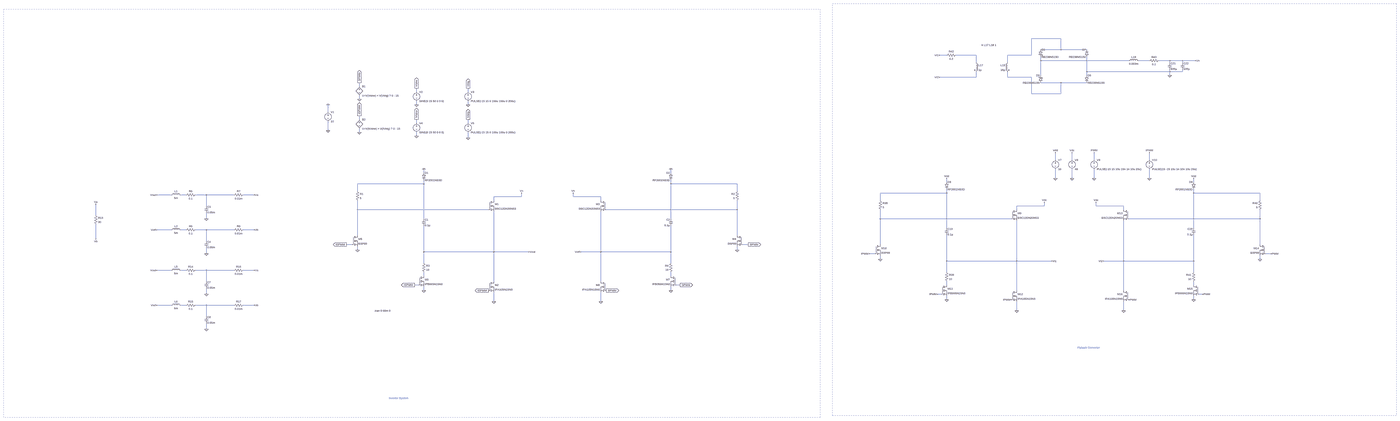
[diagram p0: schematic VFD.asc, whole sheet]
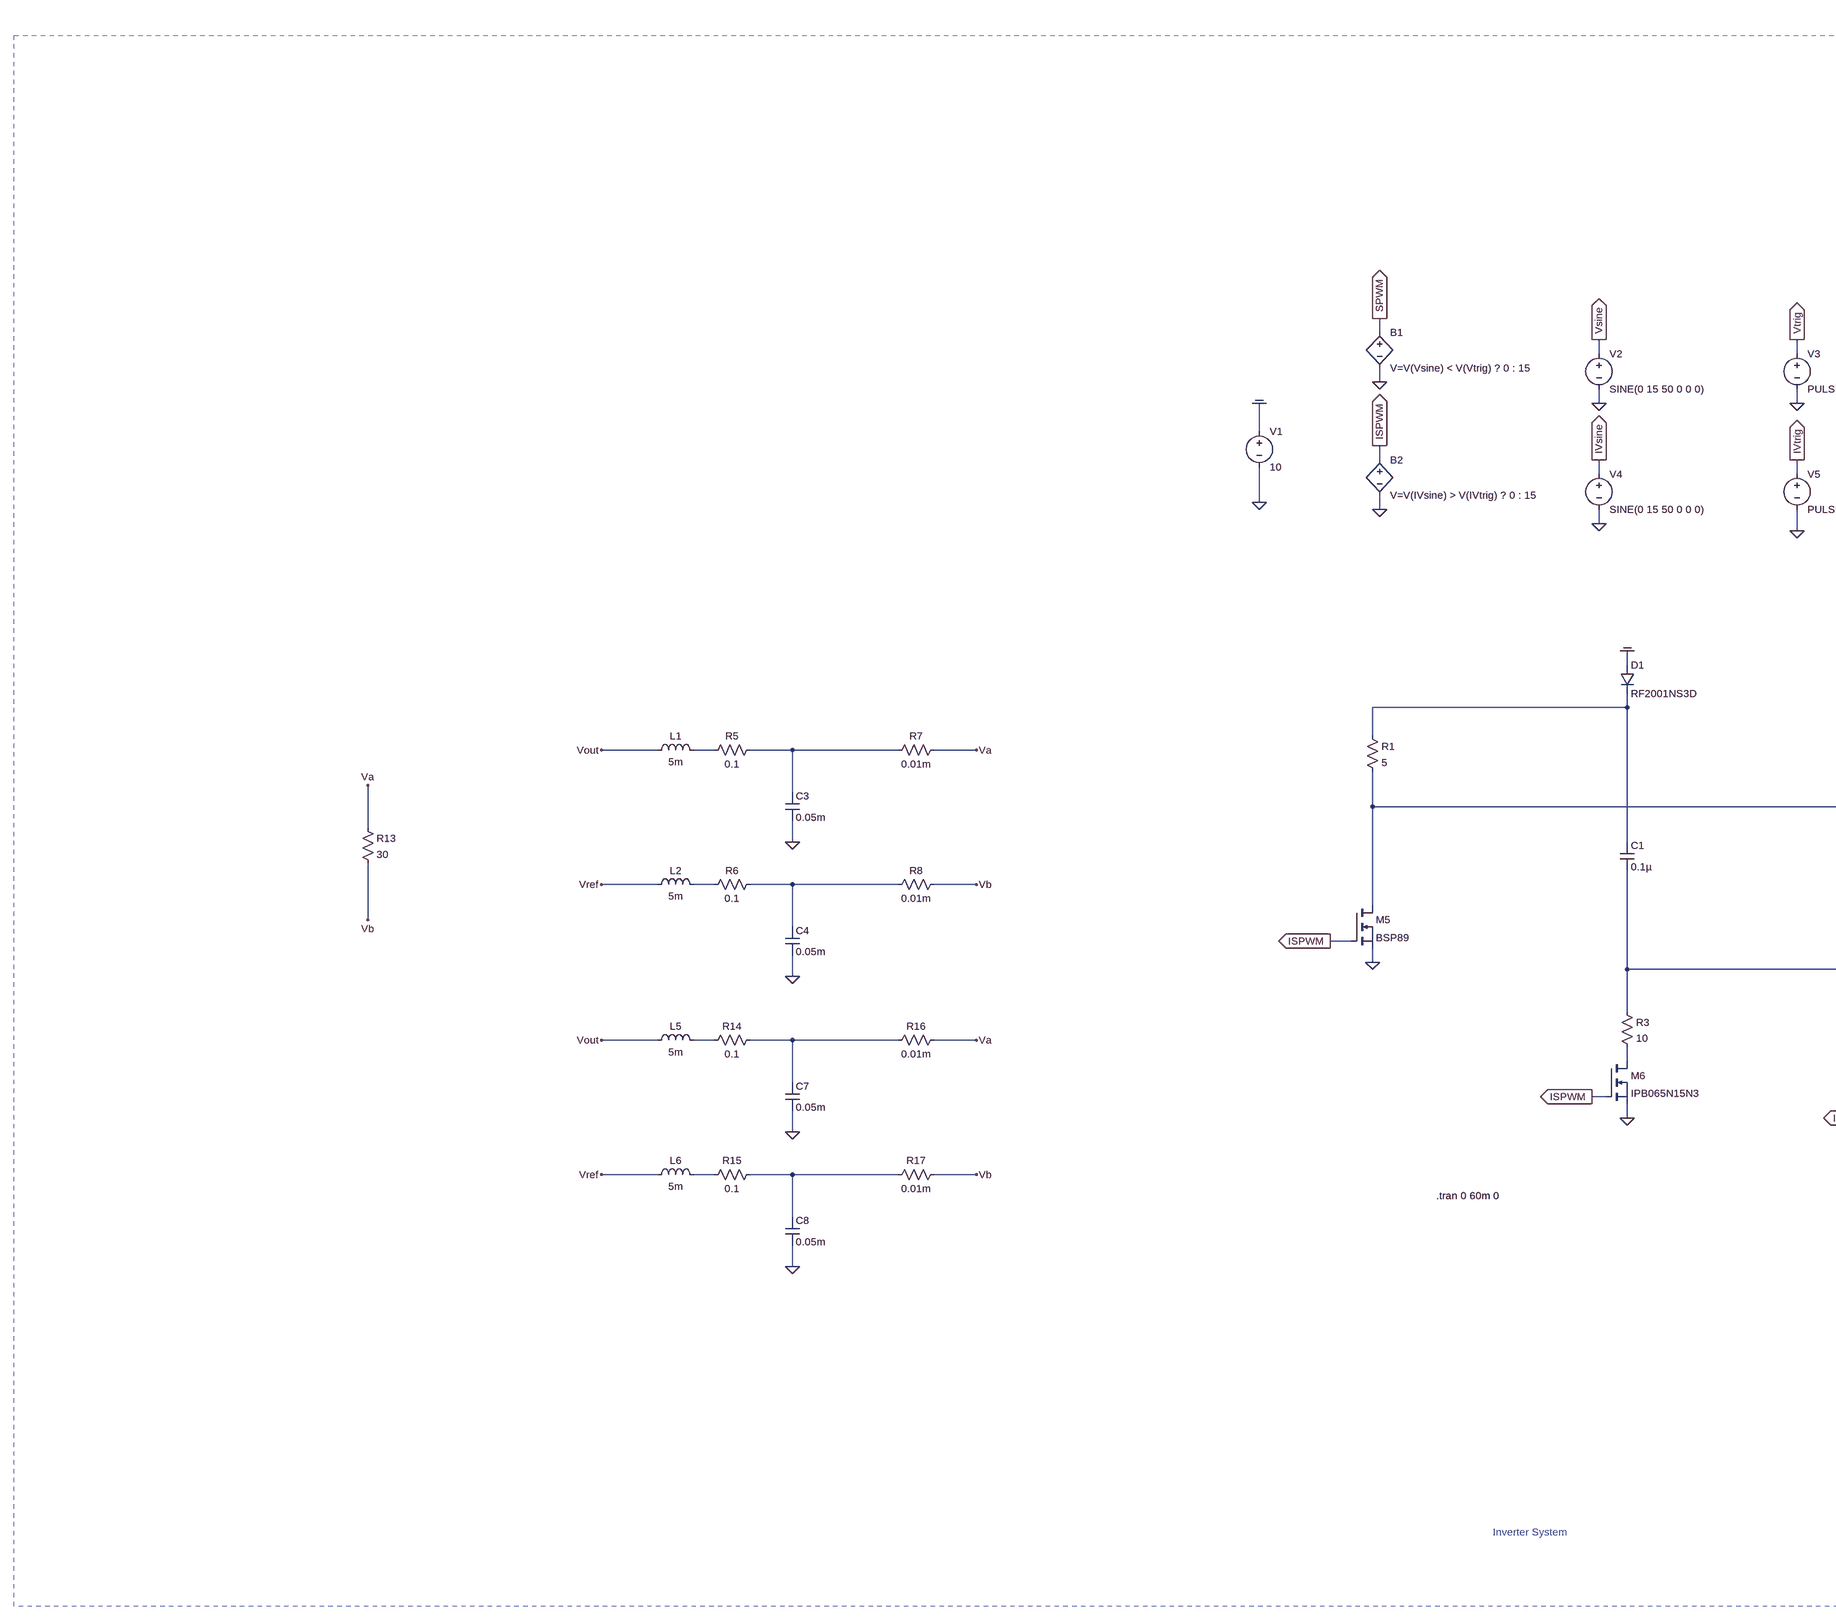
[diagram p1: schematic VFD.asc, part, row 1 of 1, column 1 of 3]
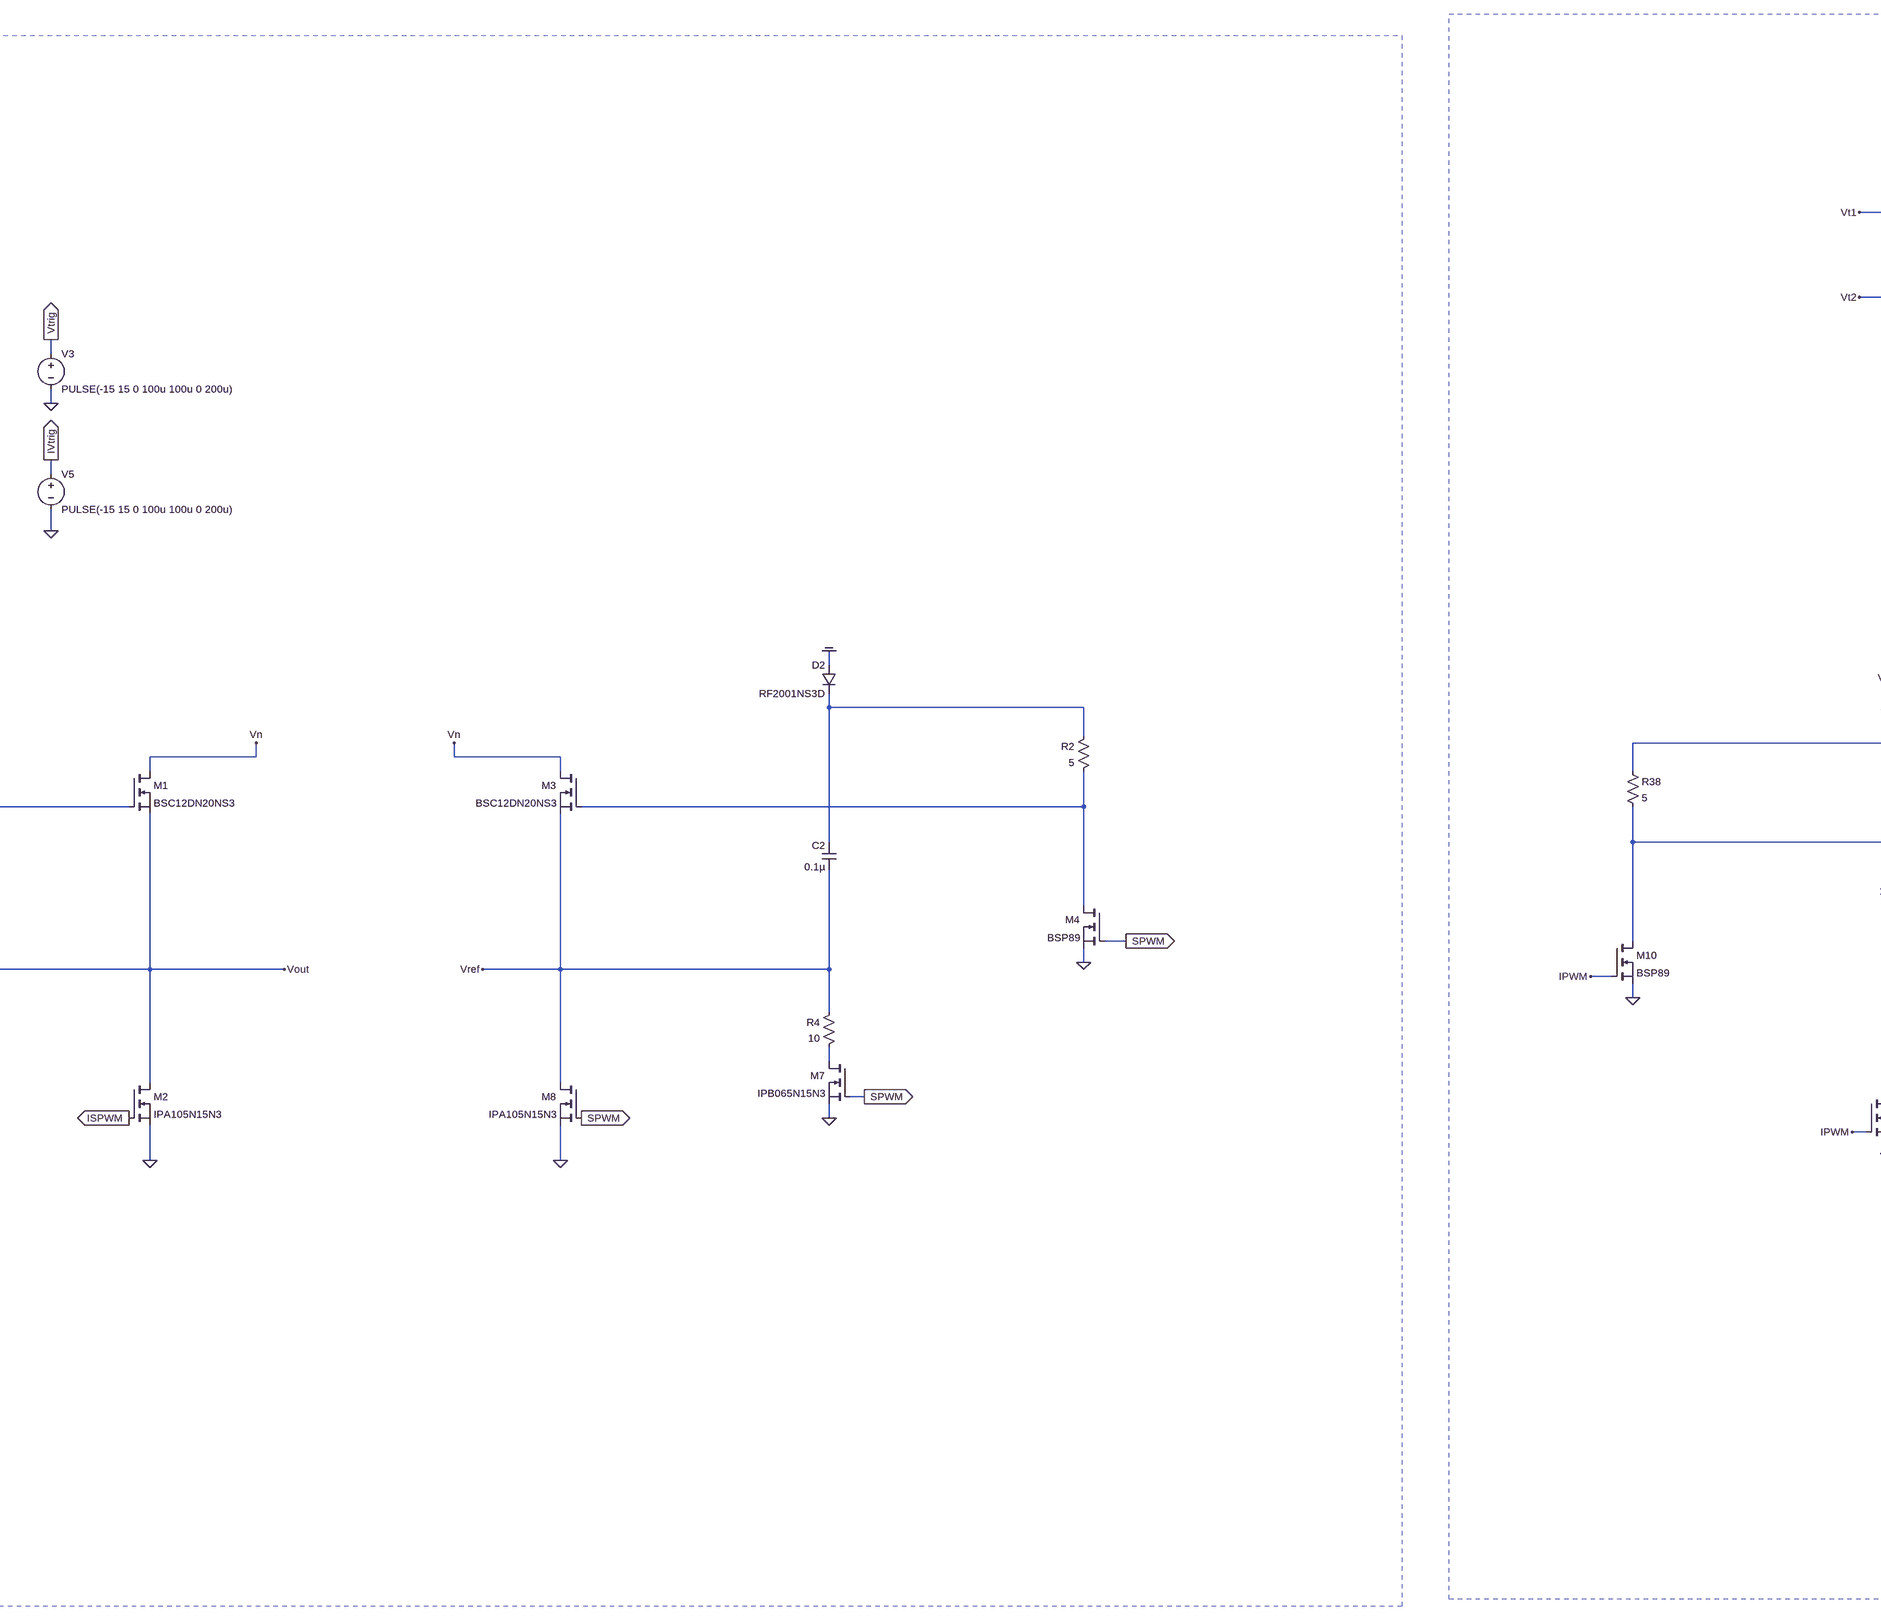
[diagram p2: schematic VFD.asc, part, row 1 of 1, column 2 of 3]
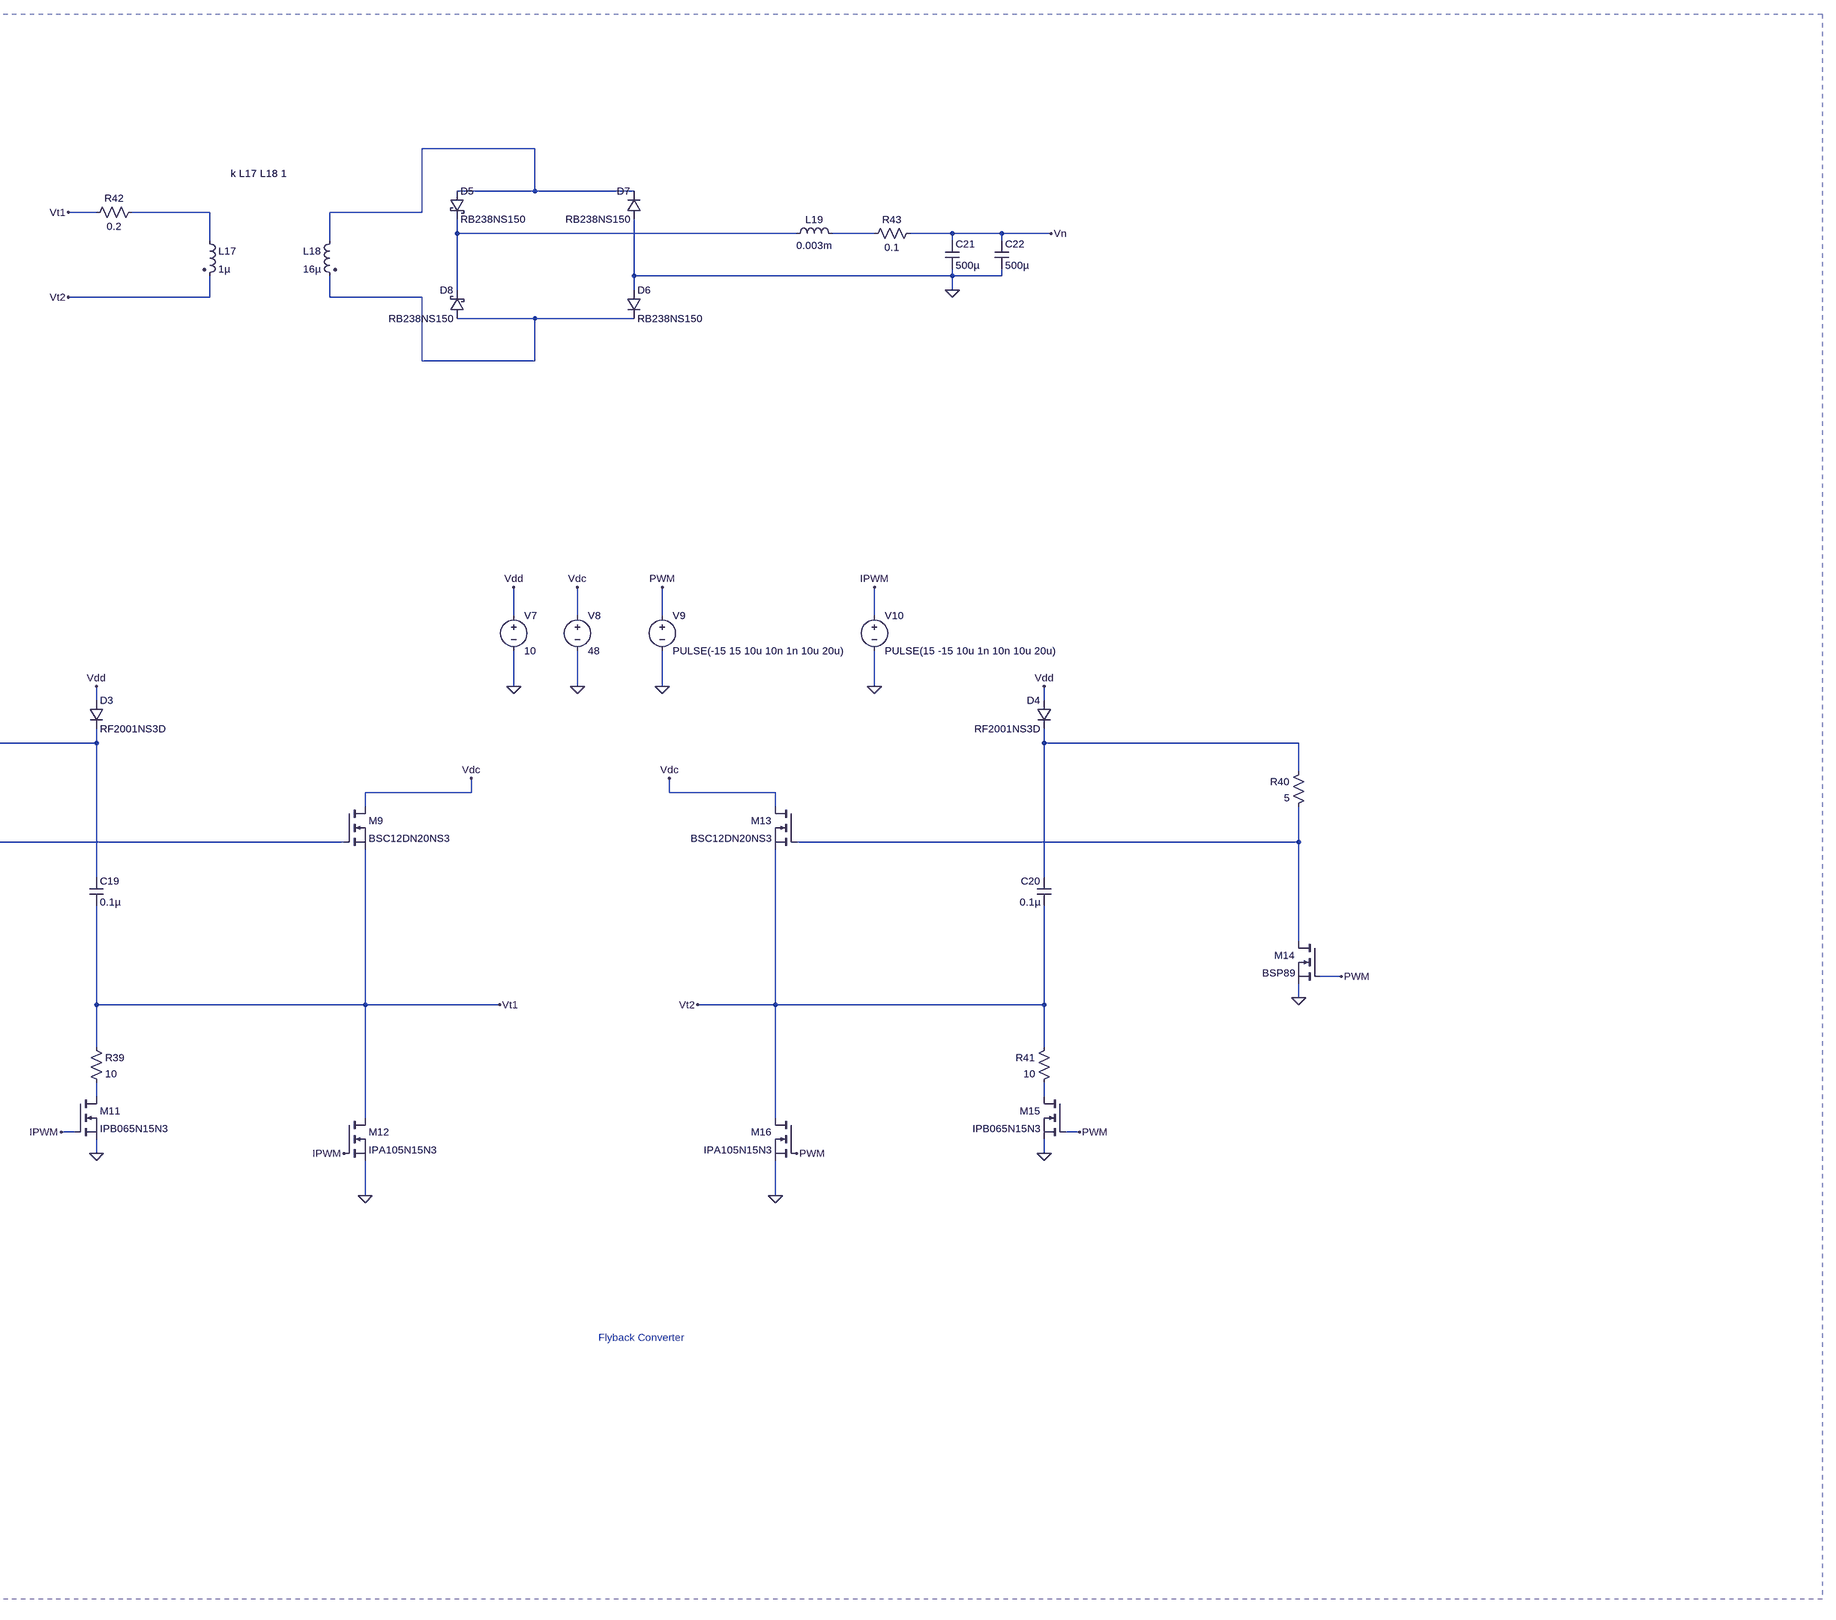
[diagram p3: schematic VFD.asc, part, row 1 of 1, column 3 of 3]
VFD.asc, the LTspice schematic file:
Version 4
SHEET 1 8900 8580
WIRE -3856 -6352 -4112 -6352
WIRE -3856 -6256 -3856 -6352
WIRE -3856 -6256 -4032 -6256
WIRE -3632 -6256 -3856 -6256
WIRE -4848 -6208 -4912 -6208
WIRE -4592 -6208 -4768 -6208
WIRE -4112 -6208 -4112 -6352
WIRE -4112 -6208 -4320 -6208
WIRE -4032 -6160 -4032 -6192
WIRE -3264 -6160 -4032 -6160
WIRE -3088 -6160 -3184 -6160
WIRE -2912 -6160 -3008 -6160
WIRE -2800 -6160 -2912 -6160
WIRE -2688 -6160 -2800 -6160
WIRE -4592 -6144 -4592 -6208
WIRE -4320 -6144 -4320 -6208
WIRE -2912 -6144 -2912 -6160
WIRE -2800 -6144 -2800 -6160
WIRE -3632 -6064 -3632 -6192
WIRE -2912 -6064 -2912 -6080
WIRE -2912 -6064 -3632 -6064
WIRE -2800 -6064 -2800 -6080
WIRE -2800 -6064 -2912 -6064
WIRE -4032 -6032 -4032 -6160
WIRE -3632 -6032 -3632 -6064
WIRE -2912 -6032 -2912 -6064
WIRE -4592 -6016 -4592 -6064
WIRE -4592 -6016 -4912 -6016
WIRE -4320 -6016 -4320 -6064
WIRE -4112 -6016 -4320 -6016
WIRE -3856 -5968 -4032 -5968
WIRE -3632 -5968 -3856 -5968
WIRE -10352 -5936 -10352 -5968
WIRE -9856 -5888 -9856 -5920
WIRE -9408 -5888 -9408 -5920
WIRE -4112 -5872 -4112 -6016
WIRE -3856 -5872 -3856 -5968
WIRE -3856 -5872 -4112 -5872
WIRE -10352 -5824 -10352 -5856
WIRE -9856 -5776 -9856 -5808
WIRE -9408 -5776 -9408 -5808
WIRE -10624 -5712 -10624 -5776
WIRE -10352 -5648 -10352 -5680
WIRE -9856 -5616 -9856 -5648
WIRE -9408 -5616 -9408 -5648
WIRE -10624 -5552 -10624 -5632
WIRE -10352 -5536 -10352 -5568
WIRE -9856 -5504 -9856 -5536
WIRE -9408 -5488 -9408 -5536
WIRE -3904 -5296 -3904 -5360
WIRE -3760 -5296 -3760 -5360
WIRE -3568 -5296 -3568 -5360
WIRE -3088 -5296 -3088 -5360
WIRE -9792 -5184 -9792 -5216
WIRE -7648 -5184 -7648 -5216
WIRE -3904 -5136 -3904 -5216
WIRE -3760 -5136 -3760 -5216
WIRE -3568 -5136 -3568 -5216
WIRE -3088 -5136 -3088 -5216
WIRE -4848 -5104 -4848 -5136
WIRE -2704 -5104 -2704 -5136
WIRE -9792 -5088 -9792 -5120
WIRE -9792 -5088 -10368 -5088
WIRE -7648 -5088 -7648 -5120
WIRE -7072 -5088 -7648 -5088
WIRE -10368 -5024 -10368 -5088
WIRE -7072 -5024 -7072 -5088
WIRE -4848 -5008 -4848 -5040
WIRE -4848 -5008 -5424 -5008
WIRE -2704 -5008 -2704 -5040
WIRE -2128 -5008 -2704 -5008
WIRE -11984 -4992 -12112 -4992
WIRE -11856 -4992 -11904 -4992
WIRE -11680 -4992 -11776 -4992
WIRE -11440 -4992 -11680 -4992
WIRE -11264 -4992 -11360 -4992
WIRE -8944 -4976 -8944 -5008
WIRE -8944 -4976 -9184 -4976
WIRE -8496 -4976 -8496 -5008
WIRE -8256 -4976 -8496 -4976
WIRE -9184 -4944 -9184 -4976
WIRE -8256 -4944 -8256 -4976
WIRE -5424 -4944 -5424 -5008
WIRE -2128 -4944 -2128 -5008
WIRE -11680 -4896 -11680 -4992
WIRE -4000 -4896 -4000 -4928
WIRE -4000 -4896 -4240 -4896
WIRE -3552 -4896 -3552 -4928
WIRE -3312 -4896 -3552 -4896
WIRE -10368 -4864 -10368 -4944
WIRE -9232 -4864 -10368 -4864
WIRE -7072 -4864 -7072 -4944
WIRE -7072 -4864 -8208 -4864
WIRE -4240 -4864 -4240 -4896
WIRE -3312 -4864 -3312 -4896
WIRE -12640 -4816 -12640 -4912
WIRE -11680 -4784 -11680 -4832
WIRE -9792 -4784 -9792 -5088
WIRE -7648 -4784 -7648 -5088
WIRE -5424 -4784 -5424 -4864
WIRE -4288 -4784 -5424 -4784
WIRE -2128 -4784 -2128 -4864
WIRE -2128 -4784 -3264 -4784
WIRE -4848 -4704 -4848 -5008
WIRE -2704 -4704 -2704 -5008
WIRE -11984 -4688 -12112 -4688
WIRE -11856 -4688 -11904 -4688
WIRE -11680 -4688 -11776 -4688
WIRE -11440 -4688 -11680 -4688
WIRE -11264 -4688 -11360 -4688
WIRE -10368 -4640 -10368 -4864
WIRE -7072 -4640 -7072 -4864
WIRE -12640 -4608 -12640 -4736
WIRE -11680 -4592 -11680 -4688
WIRE -10416 -4560 -10464 -4560
WIRE -6976 -4560 -7024 -4560
WIRE -5424 -4560 -5424 -4784
WIRE -2128 -4560 -2128 -4784
WIRE -10368 -4512 -10368 -4544
WIRE -7072 -4512 -7072 -4544
WIRE -9792 -4496 -9792 -4720
WIRE -9184 -4496 -9184 -4848
WIRE -9184 -4496 -9792 -4496
WIRE -8880 -4496 -9184 -4496
WIRE -8256 -4496 -8256 -4848
WIRE -8256 -4496 -8432 -4496
WIRE -7648 -4496 -7648 -4720
WIRE -7648 -4496 -8256 -4496
WIRE -11680 -4480 -11680 -4528
WIRE -5472 -4480 -5520 -4480
WIRE -2032 -4480 -2080 -4480
WIRE -5424 -4432 -5424 -4464
WIRE -2128 -4432 -2128 -4464
WIRE -4848 -4416 -4848 -4640
WIRE -4240 -4416 -4240 -4768
WIRE -4240 -4416 -4848 -4416
WIRE -3936 -4416 -4240 -4416
WIRE -3312 -4416 -3312 -4768
WIRE -3312 -4416 -3488 -4416
WIRE -2704 -4416 -2704 -4640
WIRE -2704 -4416 -3312 -4416
WIRE -9792 -4400 -9792 -4496
WIRE -7648 -4400 -7648 -4496
WIRE -11984 -4336 -12112 -4336
WIRE -11856 -4336 -11904 -4336
WIRE -11680 -4336 -11776 -4336
WIRE -11440 -4336 -11680 -4336
WIRE -11264 -4336 -11360 -4336
WIRE -4848 -4320 -4848 -4416
WIRE -2704 -4320 -2704 -4416
WIRE -9792 -4288 -9792 -4320
WIRE -7648 -4288 -7648 -4320
WIRE -11680 -4240 -11680 -4336
WIRE -9184 -4240 -9184 -4496
WIRE -8256 -4240 -8256 -4496
WIRE -9840 -4208 -9872 -4208
WIRE -7568 -4208 -7600 -4208
WIRE -4848 -4208 -4848 -4240
WIRE -2704 -4208 -2704 -4240
WIRE -9792 -4160 -9792 -4192
WIRE -7648 -4160 -7648 -4192
WIRE -4240 -4160 -4240 -4416
WIRE -3312 -4160 -3312 -4416
WIRE -11680 -4128 -11680 -4176
WIRE -4896 -4128 -4928 -4128
WIRE -2624 -4128 -2656 -4128
WIRE -4848 -4080 -4848 -4112
WIRE -2704 -4080 -2704 -4112
WIRE -9184 -4064 -9184 -4144
WIRE -8256 -4064 -8256 -4144
WIRE -11984 -4032 -12112 -4032
WIRE -11856 -4032 -11904 -4032
WIRE -11680 -4032 -11776 -4032
WIRE -11440 -4032 -11680 -4032
WIRE -11264 -4032 -11360 -4032
WIRE -4240 -3984 -4240 -4064
WIRE -3312 -3984 -3312 -4064
WIRE -11680 -3936 -11680 -4032
WIRE -11680 -3824 -11680 -3872
FLAG -10368 -4512 0
FLAG -9792 -4160 0
FLAG -9792 -5216 COM
FLAG -9408 -5776 0
FLAG -9856 -5776 0
FLAG -9856 -5920 Vsine
IOPIN -9856 -5920 Out
FLAG -9408 -5920 Vtrig
IOPIN -9408 -5920 Out
FLAG -9856 -5504 0
FLAG -9856 -5648 IVsine
IOPIN -9856 -5648 Out
FLAG -9408 -5648 IVtrig
IOPIN -9408 -5648 Out
FLAG -10352 -5536 0
FLAG -10352 -5824 0
FLAG -10352 -5968 SPWM
IOPIN -10352 -5968 Out
FLAG -10352 -5680 ISPWM
IOPIN -10352 -5680 Out
FLAG -8880 -4496 Vout
FLAG -9408 -5488 0
FLAG -8944 -5008 Vn
FLAG -10464 -4560 ISPWM
IOPIN -10464 -4560 Out
FLAG -9872 -4208 ISPWM
IOPIN -9872 -4208 Out
FLAG -9184 -4064 0
FLAG -8208 -4160 SPWM
IOPIN -8208 -4160 Out
FLAG -7072 -4512 0
FLAG -7648 -4160 0
FLAG -7648 -5216 COM
FLAG -8496 -5008 Vn
FLAG -9232 -4160 ISPWM
IOPIN -9232 -4160 Out
FLAG -8256 -4064 0
FLAG -7568 -4208 SPWM
IOPIN -7568 -4208 Out
FLAG -6976 -4560 SPWM
IOPIN -6976 -4560 Out
FLAG -8432 -4496 Vref
FLAG -11680 -4784 0
FLAG -11680 -4480 0
FLAG -12112 -4992 Vout
FLAG -12112 -4688 Vref
FLAG -11264 -4992 Va
FLAG -11264 -4688 Vb
FLAG -12640 -4912 Va
FLAG -12640 -4608 Vb
FLAG -11680 -4128 0
FLAG -11680 -3824 0
FLAG -12112 -4336 Vout
FLAG -12112 -4032 Vref
FLAG -11264 -4336 Va
FLAG -11264 -4032 Vb
FLAG -5424 -4432 0
FLAG -4848 -4080 0
FLAG -3936 -4416 Vt1
FLAG -4240 -3984 0
FLAG -2128 -4432 0
FLAG -2704 -4080 0
FLAG -3312 -3984 0
FLAG -3488 -4416 Vt2
FLAG -3904 -5136 0
FLAG -3760 -5136 0
FLAG -3568 -5136 0
FLAG -3088 -5136 0
FLAG -3568 -5360 PWM
FLAG -3088 -5360 IPWM
FLAG -3760 -5360 Vdc
FLAG -3904 -5360 Vdd
FLAG -4848 -5136 Vdd
FLAG -2704 -5136 Vdd
FLAG -4000 -4928 Vdc
FLAG -3552 -4928 Vdc
FLAG -4928 -4128 IPWM
FLAG -5520 -4480 IPWM
FLAG -4288 -4080 IPWM
FLAG -3264 -4080 PWM
FLAG -2624 -4128 PWM
FLAG -2032 -4480 PWM
FLAG -4912 -6208 Vt1
FLAG -4912 -6016 Vt2
FLAG -2912 -6032 0
FLAG -2688 -6160 Vn
FLAG -10624 -5552 0
FLAG -10624 -5776 COM
SYMBOL nmos -9232 -4944 R0
SYMATTR InstName M1
SYMATTR Value BSC12DN20NS3
SYMBOL diode -9808 -5184 R0
SYMATTR InstName D1
SYMATTR Value RF2001NS3D
SYMBOL cap -9808 -4784 R0
SYMATTR InstName C1
SYMATTR Value 0.1µ
SYMBOL res -10384 -5040 R0
SYMATTR InstName R1
SYMATTR Value 5
SYMBOL voltage -9856 -5904 R0
WINDOW 123 0 0 Left 0
WINDOW 39 0 0 Left 0
SYMATTR InstName V2
SYMATTR Value SINE(0 15 50 0 0 0)
SYMBOL voltage -9408 -5904 R0
WINDOW 123 0 0 Left 0
WINDOW 39 0 0 Left 0
SYMATTR InstName V3
SYMATTR Value PULSE(-15 15 0 100u 100u 0 200u)
SYMBOL voltage -9856 -5632 R0
WINDOW 123 0 0 Left 0
WINDOW 39 0 0 Left 0
SYMATTR InstName V4
SYMATTR Value SINE(0 15 50 0 0 0)
SYMBOL voltage -9408 -5632 R0
WINDOW 123 0 0 Left 0
WINDOW 39 0 0 Left 0
SYMATTR InstName V5
SYMATTR Value PULSE(-15 15 0 100u 100u 0 200u)
SYMBOL bv -10352 -5952 R0
SYMATTR InstName B1
SYMATTR Value V=V(Vsine) < V(Vtrig) ? 0 : 15
SYMBOL bv -10352 -5664 R0
SYMATTR InstName B2
SYMATTR Value V=V(IVsine) > V(IVtrig) ? 0 : 15
SYMBOL nmos -10416 -4640 R0
SYMATTR InstName M5
SYMATTR Value BSP89
SYMBOL nmos -9840 -4288 R0
SYMATTR InstName M6
SYMATTR Value IPB065N15N3
SYMBOL res -9808 -4416 R0
SYMATTR InstName R3
SYMATTR Value 10
SYMBOL nmos -9232 -4240 R0
SYMATTR InstName M2
SYMATTR Value IPA105N15N3
SYMBOL nmos -8208 -4944 M0
SYMATTR InstName M3
SYMATTR Value BSC12DN20NS3
SYMBOL diode -7632 -5184 M0
SYMATTR InstName D2
SYMATTR Value RF2001NS3D
SYMBOL cap -7632 -4784 M0
SYMATTR InstName C2
SYMATTR Value 0.1µ
SYMBOL res -7056 -5040 M0
SYMATTR InstName R2
SYMATTR Value 5
SYMBOL nmos -7024 -4640 M0
SYMATTR InstName M4
SYMATTR Value BSP89
SYMBOL nmos -7600 -4288 M0
SYMATTR InstName M7
SYMATTR Value IPB065N15N3
SYMBOL res -7632 -4416 M0
SYMATTR InstName R4
SYMATTR Value 10
SYMBOL nmos -8208 -4240 M0
SYMATTR InstName M8
SYMATTR Value IPA105N15N3
SYMBOL ind -12000 -4976 R270
WINDOW 0 32 56 VTop 2
WINDOW 3 5 56 VBottom 2
SYMATTR InstName L1
SYMATTR Value 5m
SYMBOL cap -11696 -4896 R0
SYMATTR InstName C3
SYMATTR Value 0.05m
SYMBOL ind -12000 -4672 R270
WINDOW 0 32 56 VTop 2
WINDOW 3 5 56 VBottom 2
SYMATTR InstName L2
SYMATTR Value 5m
SYMBOL cap -11696 -4592 R0
SYMATTR InstName C4
SYMATTR Value 0.05m
SYMBOL res -11760 -5008 R90
WINDOW 0 0 56 VBottom 2
WINDOW 3 32 56 VTop 2
SYMATTR InstName R5
SYMATTR Value 0.1
SYMBOL res -11760 -4704 R90
WINDOW 0 0 56 VBottom 2
WINDOW 3 32 56 VTop 2
SYMATTR InstName R6
SYMATTR Value 0.1
SYMBOL res -11344 -5008 R90
WINDOW 0 0 56 VBottom 2
WINDOW 3 32 56 VTop 2
SYMATTR InstName R7
SYMATTR Value 0.01m
SYMBOL res -11344 -4704 R90
WINDOW 0 0 56 VBottom 2
WINDOW 3 32 56 VTop 2
SYMATTR InstName R8
SYMATTR Value 0.01m
SYMBOL res -12656 -4832 R0
SYMATTR InstName R13
SYMATTR Value 30
SYMBOL ind -12000 -4320 R270
WINDOW 0 32 56 VTop 2
WINDOW 3 5 56 VBottom 2
SYMATTR InstName L5
SYMATTR Value 5m
SYMBOL cap -11696 -4240 R0
SYMATTR InstName C7
SYMATTR Value 0.05m
SYMBOL ind -12000 -4016 R270
WINDOW 0 32 56 VTop 2
WINDOW 3 5 56 VBottom 2
SYMATTR InstName L6
SYMATTR Value 5m
SYMBOL cap -11696 -3936 R0
SYMATTR InstName C8
SYMATTR Value 0.05m
SYMBOL res -11760 -4352 R90
WINDOW 0 0 56 VBottom 2
WINDOW 3 32 56 VTop 2
SYMATTR InstName R14
SYMATTR Value 0.1
SYMBOL res -11760 -4048 R90
WINDOW 0 0 56 VBottom 2
WINDOW 3 32 56 VTop 2
SYMATTR InstName R15
SYMATTR Value 0.1
SYMBOL res -11344 -4352 R90
WINDOW 0 0 56 VBottom 2
WINDOW 3 32 56 VTop 2
SYMATTR InstName R16
SYMATTR Value 0.01m
SYMBOL res -11344 -4048 R90
WINDOW 0 0 56 VBottom 2
WINDOW 3 32 56 VTop 2
SYMATTR InstName R17
SYMATTR Value 0.01m
SYMBOL nmos -4288 -4864 R0
SYMATTR InstName M9
SYMATTR Value BSC12DN20NS3
SYMBOL diode -4864 -5104 R0
SYMATTR InstName D3
SYMATTR Value RF2001NS3D
SYMBOL cap -4864 -4704 R0
SYMATTR InstName C19
SYMATTR Value 0.1µ
SYMBOL res -5440 -4960 R0
SYMATTR InstName R38
SYMATTR Value 5
SYMBOL nmos -5472 -4560 R0
SYMATTR InstName M10
SYMATTR Value BSP89
SYMBOL nmos -4896 -4208 R0
SYMATTR InstName M11
SYMATTR Value IPB065N15N3
SYMBOL res -4864 -4336 R0
SYMATTR InstName R39
SYMATTR Value 10
SYMBOL nmos -4288 -4160 R0
SYMATTR InstName M12
SYMATTR Value IPA105N15N3
SYMBOL nmos -3264 -4864 M0
SYMATTR InstName M13
SYMATTR Value BSC12DN20NS3
SYMBOL diode -2688 -5104 M0
SYMATTR InstName D4
SYMATTR Value RF2001NS3D
SYMBOL cap -2688 -4704 M0
SYMATTR InstName C20
SYMATTR Value 0.1µ
SYMBOL res -2112 -4960 M0
SYMATTR InstName R40
SYMATTR Value 5
SYMBOL nmos -2080 -4560 M0
SYMATTR InstName M14
SYMATTR Value BSP89
SYMBOL nmos -2656 -4208 M0
SYMATTR InstName M15
SYMATTR Value IPB065N15N3
SYMBOL res -2688 -4336 M0
SYMATTR InstName R41
SYMATTR Value 10
SYMBOL nmos -3264 -4160 M0
SYMATTR InstName M16
SYMATTR Value IPA105N15N3
SYMBOL voltage -3904 -5312 R0
WINDOW 123 0 0 Left 0
WINDOW 39 0 0 Left 0
SYMATTR InstName V7
SYMATTR Value 10
SYMBOL voltage -3760 -5312 R0
WINDOW 123 0 0 Left 0
WINDOW 39 0 0 Left 0
SYMATTR InstName V8
SYMATTR Value 48
SYMBOL voltage -3568 -5312 R0
WINDOW 123 0 0 Left 0
WINDOW 39 0 0 Left 0
SYMATTR InstName V9
SYMATTR Value PULSE(-15 15 10u 10n 1n 10u 20u)
SYMBOL voltage -3088 -5312 R0
WINDOW 123 0 0 Left 0
WINDOW 39 0 0 Left 0
SYMATTR InstName V10
SYMATTR Value PULSE(15 -15 10u 1n 10n 10u 20u)
SYMBOL ind2 -4608 -6160 R0
SYMATTR InstName L17
SYMATTR Value 1µ
SYMATTR Type ind
SYMBOL ind2 -4304 -6160 M0
SYMATTR InstName L18
SYMATTR Value 16µ
SYMATTR Type ind
SYMBOL res -4752 -6224 R90
WINDOW 0 0 56 VBottom 2
WINDOW 3 32 56 VTop 2
SYMATTR InstName R42
SYMATTR Value 0.2
SYMBOL schottky -4048 -6256 R0
SYMATTR InstName D5
SYMATTR Value RB238NS150
SYMATTR Description Diode
SYMATTR Type diode
SYMBOL diode -3648 -6032 R0
SYMATTR InstName D6
SYMATTR Value RB238NS150
SYMBOL diode -3616 -6192 R180
WINDOW 0 24 64 Left 2
WINDOW 3 24 0 Left 2
SYMATTR InstName D7
SYMATTR Value RB238NS150
SYMBOL schottky -4016 -5968 R180
WINDOW 0 24 64 Left 2
WINDOW 3 24 0 Left 2
SYMATTR InstName D8
SYMATTR Value RB238NS150
SYMATTR Description Diode
SYMATTR Type diode
SYMBOL ind -3280 -6144 R270
WINDOW 0 32 56 VTop 2
WINDOW 3 5 56 VBottom 2
SYMATTR InstName L19
SYMATTR Value 0.003m
SYMBOL cap -2928 -6144 R0
SYMATTR InstName C21
SYMATTR Value 500µ
SYMBOL res -2992 -6176 R90
WINDOW 0 0 56 VBottom 2
WINDOW 3 32 56 VTop 2
SYMATTR InstName R43
SYMATTR Value 0.1
SYMBOL cap -2816 -6144 R0
SYMATTR InstName C22
SYMATTR Value 500µ
SYMBOL voltage -10624 -5728 R0
WINDOW 123 0 0 Left 0
WINDOW 39 0 0 Left 0
SYMATTR InstName V1
SYMATTR Value 10
TEXT -10224 -3984 Left 2 !.tran 0 60m 0
TEXT -4544 -6296 Left 2 !k L17 L18 1
TEXT -3712 -3664 Left 2 ;Flyback Converter
TEXT -10096 -3224 Left 2 ;Inverter System
RECTANGLE Normal -6352 -3056 -13440 -6608 2
RECTANGLE Normal -944 -3072 -5840 -6656 2

The netlist it stands for:
* VFD.asc
M1 Vn N012 Vout Vout BSC12DN20NS3
D1 COM N006 RF2001NS3D
C1 N006 Vout 0.1µ
R1 N006 N012 5
V2 Vsine 0 SINE(0 15 50 0 0 0)
V3 Vtrig 0 PULSE(-15 15 0 100u 100u 0 200u)
V4 IVsine 0 SINE(0 15 50 0 0 0)
V5 IVtrig 0 PULSE(-15 15 0 100u 100u 0 200u)
B1 SPWM 0 V=V(Vsine) < V(Vtrig) ? 0 : 15
B2 ISPWM 0 V=V(IVsine) > V(IVtrig) ? 0 : 15
M5 N012 ISPWM 0 0 BSP89
M6 N020 ISPWM 0 0 IPB065N15N3
R3 Vout N020 10
M2 Vout ISPWM 0 0 IPA105N15N3
M3 Vn N013 Vref Vref BSC12DN20NS3
D2 COM N007 RF2001NS3D
C2 N007 Vref 0.1µ
R2 N007 N013 5
M4 N013 SPWM 0 0 BSP89
M7 N021 SPWM 0 0 IPB065N15N3
R4 Vref N021 10
M8 Vref SPWM 0 0 IPA105N15N3
L1 Vout N010 5m
C3 N011 0 0.05m
L2 Vref N016 5m
C4 N017 0 0.05m
R5 N011 N010 0.1
R6 N017 N016 0.1
R7 Va N011 0.01m
R8 Vb N017 0.01m
R13 Va Vb 30
L5 Vout N018 5m
C7 N019 0 0.05m
L6 Vref N024 5m
C8 N025 0 0.05m
R14 N019 N018 0.1
R15 N025 N024 0.1
R16 Va N019 0.01m
R17 Vb N025 0.01m
M9 Vdc N014 Vt1 Vt1 BSC12DN20NS3
D3 Vdd N008 RF2001NS3D
C19 N008 Vt1 0.1µ
R38 N008 N014 5
M10 N014 IPWM 0 0 BSP89
M11 N022 IPWM 0 0 IPB065N15N3
R39 Vt1 N022 10
M12 Vt1 IPWM 0 0 IPA105N15N3
M13 Vdc N015 Vt2 Vt2 BSC12DN20NS3
D4 Vdd N009 RF2001NS3D
C20 N009 Vt2 0.1µ
R40 N009 N015 5
M14 N015 PWM 0 0 BSP89
M15 N023 PWM 0 0 IPB065N15N3
R41 Vt2 N023 10
M16 Vt2 PWM 0 0 IPA105N15N3
V7 Vdd 0 10
V8 Vdc 0 48
V9 PWM 0 PULSE(-15 15 10u 10n 1n 10u 20u)
V10 IPWM 0 PULSE(15 -15 10u 1n 10n 10u 20u)
L17 N002 Vt2 1µ
L18 N001 N005 16µ
R42 N002 Vt1 0.2
D5 N001 N003 RB238NS150
D6 0 N005 RB238NS150
D7 0 N001 RB238NS150
D8 N005 N003 RB238NS150
L19 N003 N004 0.003m
C21 Vn 0 500µ
R43 Vn N004 0.1
C22 Vn 0 500µ
V1 COM 0 10
.model D D
.lib standard.dio
.model NMOS NMOS
.model PMOS PMOS
.lib standard.mos
.tran 0 60m 0
k L17 L18 1
* Flyback Converter
* Inverter System
.backanno
.end